# Altium project USBIsolator.PrjPcb
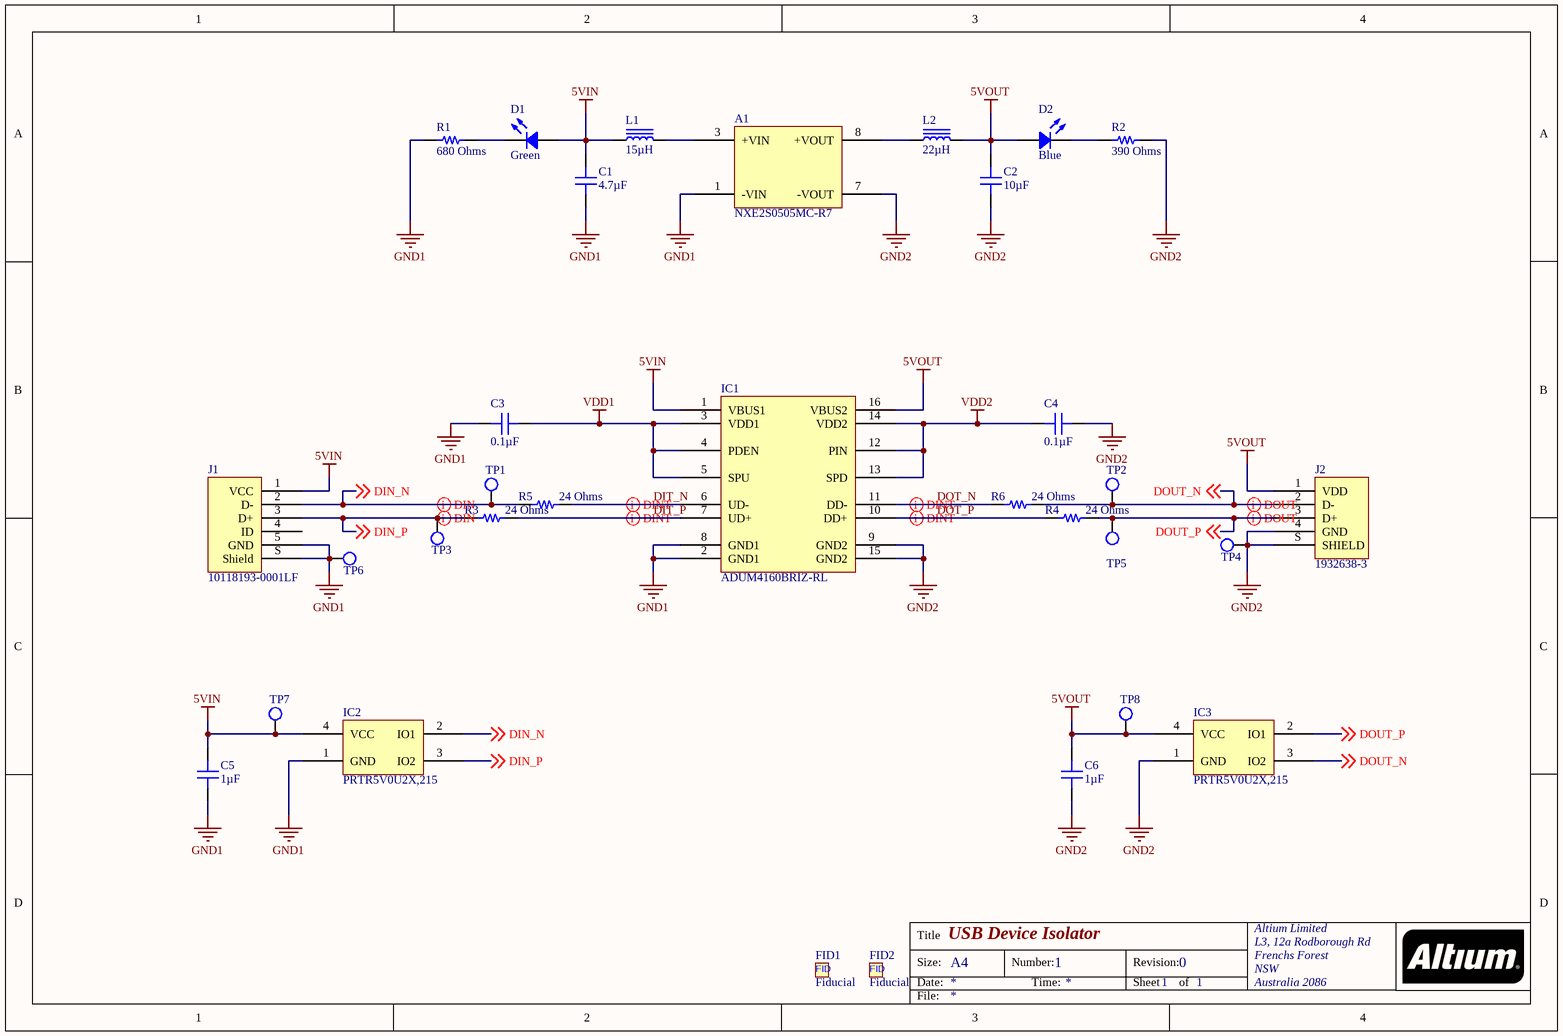
[diagram p0: USB Isolator.SchDoc]
1 sheet, 32 parts. Net scope: global (net labels, ports and power ports of the same name join across sheets).
Board files: USB Isolator Board.PcbDoc, USB Isolator Panel.PcbDoc

## Sheet USB Isolator.SchDoc: USB Device Isolator
size A4; Organization: Altium Limited; Address1: L3, 12a Rodborough Rd; Address2: Frenchs Forest; Address3: NSW; Address4: Australia 2086; DocumentNumber: 1; Revision: 0; SheetNumber: 1; SheetTotal: 1

### Parts
A1  NXE2S0505MC-R7  [MURATA NXE]
C1  4.7µF  [CAP 1206_3216 - 1.8MM]
C2  10µF  [CAP 1206_3216 - 1.8MM]
C3  0.1µF  [CAP 0603_1608]
C4  0.1µF  [CAP 0603_1608]
C5  1µF  [CAP 0603_1608]
C6  1µF  [CAP 0603_1608]
D1  Green  [LED 0603_1608 GREEN]
D2  Blue  [LED 0603_1608 BLUE]
FID1  Fiducial  [Fiducial-1mm]
FID2  Fiducial  [Fiducial-1mm]
IC1  ADUM4160BRIZ-RL  [ANALOG DEV SOIC-16 RI-16-1]
IC2  PRTR5V0U2X,215  [SOT143B]
IC3  PRTR5V0U2X,215  [SOT143B]
J1  10118193-0001LF  [FCI USB 10118193-0001LF]
J2  1932638-3  [TE 1932638-3 USB2.0A]
L1  15µH  [TDK VLCF4028-2]
L2  22µH  [TDK VLCF4024-2]
R1  680 Ohms  [RES 0603_1608]
R2  390 Ohms  [RES 0603_1608]
R3  24 Ohms  [RES 0603_1608]
R4  24 Ohms  [RES 0603_1608]
R5  24 Ohms  [RES 0603_1608]
R6  24 Ohms  [RES 0603_1608]
TP1  Test Point  [TestPoint-1.5mm]  (value not drawn)  (no BOM)
TP2  Test Point  [TestPoint-1.5mm]  (value not drawn)  (no BOM)
TP3  Test Point  [TestPoint-1.5mm]  (value not drawn)  (no BOM)
TP4  Test Point  [TestPoint-1.5mm]  (value not drawn)  (no BOM)
TP5  Test Point  [TestPoint-1.5mm]  (value not drawn)  (no BOM)
TP6  Test Point  [TestPoint-1.5mm]  (value not drawn)  (no BOM)
TP7  Test Point  [TestPoint-1.5mm]  (value not drawn)  (no BOM)
TP8  Test Point  [TestPoint-1.5mm]  (value not drawn)  (no BOM)

### Nets
5VIN: C1.1 C5.1 D1.1 IC1.1(VBUS1) IC2.4(VCC) J1.1(VCC) L1.1 TP7.1(TP)
5VOUT: C2.1 C6.1 D2.1 IC1.16(VBUS2) IC3.4(VCC) J2.1(VDD) L2.2 TP8.1(TP)
GND1: A1.1(-VIN) C1.2 C3.1 C5.2 IC1.2(GND1) IC1.8(GND1) IC2.1(GND) J1.5(GND) J1.S(Shield) R1.1 TP6.1(TP)
GND2: A1.7(-VOUT) C2.2 C4.1 C6.2 IC1.9(GND2) IC1.15(GND2) IC3.1(GND) J2.4(GND) J2.S(SHIELD) R2.2 TP4.1(TP)
VDD1: C3.2 IC1.3(VDD1) IC1.4(PDEN) IC1.5(SPU)
VDD2: C4.2 IC1.12(PIN) IC1.13(SPD) IC1.14(VDD2)
DIN_N: IC2.2(IO1) J1.2(D-) R5.2 TP1.1(TP) ; off-sheet DIN_N
DIN_P: IC2.3(IO2) J1.3(D+) R3.2 TP3.1(TP) ; off-sheet DIN_P
DIT_N: IC1.6(UD-) R5.1
DIT_P: IC1.7(UD+) R3.1
DOT_N: IC1.11(DD-) R6.2
DOT_P: IC1.10(DD+) R4.2
DOUT_N: IC3.3(IO2) J2.2(D-) R6.1 TP2.1(TP) ; off-sheet DOUT_N
DOUT_P: IC3.2(IO1) J2.3(D+) R4.1 TP5.1(TP) ; off-sheet DOUT_P
NetA1_3: A1.3(+VIN) L1.2
NetA1_8: A1.8(+VOUT) L2.1
NetD1_2: D1.2 R1.2
NetD2_2: D2.2 R2.1

Not connected (* = marked no-connect by the designer): J1 4(ID)

### Layout directives
differential pair: DIN_N, DIN_P, DIT_N, DIT_P, DOT_N, DOT_P, DOUT_N, DOUT_P

### Notes on the sheet
- Title
- Size:
- Date:
- A4
- Number:
- Time:
- Revision:
- Sheet
- of
- File:
- (in symbol Fiducial) FID

### Library data of the parts
A1 = NXE2S0505MC-R7: DC DC CONVERTER 5V 2W; Manufacturer: Murata Power Solutions Inc.; Current - Output (Max): 400mA; Efficiency: 72%; Number of Outputs: 1; Voltage - Input (Max): 5.5V; Voltage - Input (Min): 4.5V; Voltage - Isolation: 3kV; Part Number: NXE2S0505MC-R7; Applications: ITE (Commercial); ComponentLink1Description: Datasheet; ComponentLink1URL: https://power.murata.com/data/power/ncl/kdc_nxe2.pdf; ComponentLink2Description: DigiKey Link; ComponentLink2URL: //digikey.com/product-detail/en/murata-power-solutions-inc/NXE2S0505MC-R7/811-3182-2-ND/6009739; Device Package: 14-SMD Module, 5 Leads; Features: SCP; LastUpdated: 04/12/2019 23:42:39; Lifecycle Status: 0; Minimum Order: 1; Mounting Type: Surface Mount; Operating Temperature: -40°C ~ 85°C; Package / Case: 14-SMD Module, 5 Leads; Packaging: TapeAndReel; PartId: 2; Part Status: Active; Power (Watts): 2W; Price: 3.83; Series: NXE2 (2W); Size / Dimension: 0.50" L x 0.40" W x 0.17" H (12.7mm x 10.4mm x 4.4mm); Supplier 1: DigiKey; Supplier Part Number 1: 811-3182-2-ND; Type: Isolated Module; Voltage - Output 1: 5V
C1 = CL31B475KOHNNNE: CAP CER 4.7UF 16V X7R 1206; Manufacturer: Samsung Electro-Mechanics; Tolerance: ±10%; Part Number: CL31B475KOHNNNE; Applications: General Purpose; Capacitance: 4.7µF; ComponentLink1Description: Datasheet; ComponentLink1URL: http://www.samsungsem.com/kr/support/product-search/mlcc/CL31B475KOHNNNE.jsp; ComponentLink2Description: DigiKey Link; ComponentLink2URL: //digikey.com/product-detail/en/samsung-electro-mechanics/CL31B475KOHNNNE/1276-3182-2-ND/3888840; Device Package: 1206 (3216 Metric); LastUpdated: 29/11/2019 21:36:24; Lifecycle Status: 0; Minimum Order: 1; Mounting Type: Surface Mount, MLCC; Operating Temperature: -55°C ~ 125°C; Package / Case: 1206 (3216 Metric); Packaging: TapeAndReel; PartId: 22712; Part Status: Active; Price: 0.05; Series: CL; Size / Dimension: 0.126" L x 0.063" W (3.20mm x 1.60mm); Supplier 1: DigiKey; Supplier Part Number 1: 1276-3182-2-ND; Temperature Coefficient: X7R; Thickness (Max): 0.071" (1.80mm); Value: 4.7µF; Voltage - Rated: 16V
C2 = CL31B106MOHNNNE: CAP CER 10UF 16V X7R 1206; Manufacturer: Samsung Electro-Mechanics; Tolerance: ±20%; Part Number: CL31B106MOHNNNE; Applications: General Purpose; Capacitance: 10µF; ComponentLink1Description: Datasheet; ComponentLink1URL: http://www.samsungsem.com/kr/support/product-search/mlcc/CL31B106MOHNNNE.jsp; ComponentLink2Description: DigiKey Link; ComponentLink2URL: //digikey.com/product-detail/en/samsung-electro-mechanics/CL31B106MOHNNNE/1276-6641-2-ND/5961125; Device Package: 1206 (3216 Metric); LastUpdated: 29/11/2019 21:36:18; Lifecycle Status: 0; Minimum Order: 1; Mounting Type: Surface Mount, MLCC; Operating Temperature: -55°C ~ 125°C; Package / Case: 1206 (3216 Metric); Packaging: TapeAndReel; PartId: 21983; Part Status: Active; Price: 0.04; Series: CL; Size / Dimension: 0.126" L x 0.063" W (3.20mm x 1.60mm); Supplier 1: DigiKey; Supplier Part Number 1: 1276-6641-2-ND; Temperature Coefficient: X7R; Thickness (Max): 0.071" (1.80mm); Value: 10µF; Voltage - Rated: 16V
C3 C4 = CL10B104KB8NNNL: CAP CER 0.1UF 50V X7R 0603; Manufacturer: Samsung Electro-Mechanics; Tolerance: ±10%; Part Number: CL10B104KB8NNNL; Applications: General Purpose; Capacitance: 0.1µF; ComponentLink1Description: Datasheet; ComponentLink1URL: http://www.samsungsem.com/kr/support/product-search/mlcc/CL10B104KB8NNNL.jsp; ComponentLink2Description: DigiKey Link; ComponentLink2URL: //digikey.com/product-detail/en/samsung-electro-mechanics/CL10B104KB8NNNL/1276-CL10B104KB8NNNLTR-ND/3894274; Device Package: 0603 (1608 Metric); LastUpdated: 29/11/2019 20:59:46; Lifecycle Status: 0; Minimum Order: 1; Mounting Type: Surface Mount, MLCC; Operating Temperature: -55°C ~ 125°C; Package / Case: 0603 (1608 Metric); Packaging: TapeAndReel; PartId: 3517; Part Status: Active; Price: 0.00; Series: CL; Size / Dimension: 0.063" L x 0.031" W (1.60mm x 0.80mm); Supplier 1: DigiKey; Supplier Part Number 1: 1276-CL10B104KB8NNNLTR-ND; Temperature Coefficient: X7R; Thickness (Max): 0.035" (0.90mm); Value: 0.1µF; Voltage - Rated: 50V
C5 C6 = CC0603KRX5R8BB105: CAP CER 1UF 25V X5R 0603; Manufacturer: Yageo; Tolerance: ±10%; Part Number: CC0603KRX5R8BB105; Applications: General Purpose; Capacitance: 1µF; ComponentLink1Description: Datasheet; ComponentLink1URL: https://www.yageo.com/upload/media/product/productsearch/datasheet/mlcc/UPY-GPHC_X5R_4V-to-50V_25.pdf; ComponentLink2Description: DigiKey Link; ComponentLink2URL: //digikey.com/product-detail/en/yageo/CC0603KRX5R8BB105/311-1445-2-ND/2833610; Device Package: 0603 (1608 Metric); LastUpdated: 29/11/2019 20:59:49; Lifecycle Status: 0; Minimum Order: 1; Mounting Type: Surface Mount, MLCC; Operating Temperature: -55°C ~ 85°C; Package / Case: 0603 (1608 Metric); Packaging: TapeAndReel; PartId: 5146; Part Status: Active; Price: 0.01; Series: CC; Size / Dimension: 0.063" L x 0.031" W (1.60mm x 0.80mm); Supplier 1: DigiKey; Supplier Part Number 1: 311-1445-2-ND; Temperature Coefficient: X5R; Thickness (Max): 0.035" (0.90mm); Value: 1µF; Voltage - Rated: 25V
D1 = LTST-C191KGKT: LED GREEN CLEAR SMD; Manufacturer: Lite-On Inc.; Configuration: Standard; Current - Test: 20mA; Lens Color: Colorless; Lens Size: 1.10mm x 0.80mm; Lens Style: Rectangle with Flat Top; Millicandela Rating: 35mcd; Viewing Angle: 130°; Voltage - Forward (Vf) (Typ): 2V; Wavelength - Dominant: 571nm; Wavelength - Peak: 574nm; Part Number: LTST-C191KGKT; Color: Green; ComponentLink1Description: Datasheet; ComponentLink1URL: http://optoelectronics.liteon.com/upload/download/DS22-2000-228/LTST-C191KGKT.PDF; ComponentLink2Description: DigiKey Link; ComponentLink2URL: //digikey.com/product-detail/en/lite-on-inc/LTST-C191KGKT/160-1446-2-ND/386835; Device Package: 0603 (1608 Metric); Height (Max): 0.65mm; LastUpdated: 01/12/2019 14:50:11; Lens Transparency: Clear; Lifecycle Status: 0; Minimum Order: 1; Mounting Type: Surface Mount; Package / Case: 0603 (1608 Metric); Packaging: TapeAndReel; PartId: 655; Part Status: Active; Price: 0.04; Series: -; Size / Dimension: 1.60mm L x 0.80mm W; Supplier 1: DigiKey; Supplier Part Number 1: 160-1446-2-ND; Value: Green
D2 = LTST-C194TBKT: LED BLUE CLEAR SMD; Manufacturer: Lite-On Inc.; Configuration: Standard; Current - Test: 20mA; Lens Color: Colorless; Lens Size: 1.15mm x 0.80mm; Lens Style: Rectangle with Flat Top; Millicandela Rating: 104mcd; Viewing Angle: 130°; Voltage - Forward (Vf) (Typ): 3.3V; Wavelength - Dominant: 468nm; Part Number: LTST-C194TBKT; Color: Blue; ComponentLink1Description: Datasheet; ComponentLink1URL: http://optoelectronics.liteon.com/upload/download/DS22-2010-0025/LTST-C194TBKT.PDF; ComponentLink2Description: DigiKey Link; ComponentLink2URL: //digikey.com/product-detail/en/lite-on-inc/LTST-C194TBKT/160-1837-2-ND/2356225; Device Package: 0603 (1608 Metric); Height (Max): 0.45mm; LastUpdated: 01/12/2019 14:50:37; Lens Transparency: Clear; Lifecycle Status: 0; Minimum Order: 1; Mounting Type: Surface Mount; Package / Case: 0603 (1608 Metric); Packaging: TapeAndReel; PartId: 828; Part Status: Active; Price: 0.06; Series: -; Size / Dimension: 1.60mm L x 0.80mm W; Supplier 1: DigiKey; Supplier Part Number 1: 160-1837-2-ND; Value: Blue; Wavelength - Peak: 468nm
IC1 = ADUM4160BRIZ-RL: DGTL ISOLATOR 5KV 2CH USB 16SOIC; Manufacturer: Analog Devices Inc.; Channel Type: Bidirectional; Common Mode Transient Immunity (Min): 25kV/µs; Data Rate: 12Mbps; Inputs - Side 1/Side 2: 2/2; Isolated Power: No; Number of Channels: 2; Propagation Delay tpLH / tpHL (Max): 70ns, 70ns; Rise / Fall Time (Typ): 20ns, 20ns (Max); Voltage - Isolation: 5000Vrms; Voltage - Supply: 3.1V ~ 5.5V; Part Number: ADUM4160BRIZ-RL; ComponentLink1Description: Datasheet; ComponentLink1URL: https://www.analog.com/media/en/technical-documentation/data-sheets/ADuM4160.pdf; ComponentLink2Description: DigiKey Link; ComponentLink2URL: //digikey.com/product-detail/en/analog-devices-inc/ADUM4160BRIZ-RL/ADUM4160BRIZ-RLTR-ND/2700137; Device Package: 16-SOIC (0.295", 7.50mm Width); LastUpdated: 09/12/2019 20:48:06; Lifecycle Status: 0; Minimum Order: 1; Mounting Type: Surface Mount; Operating Temperature: -40°C ~ 105°C; Package / Case: 16-SOIC (0.295", 7.50mm Width); Packaging: TapeAndReel; PartId: 48; Part Status: Active; Price: 6.80; Series: iCoupler®; Supplier 1: DigiKey; Supplier Part Number 1: ADUM4160BRIZ-RLTR-ND; Supplier Device Package: 16-SOIC-IC; Technology: Magnetic Coupling; Type: USB
IC2 IC3 = PRTR5V0U2X,215: TVS DIODE 5.5V SOT143B; Manufacturer: Nexperia USA Inc.; Capacitance @ Frequency: 1pF @ 1MHz; Power Line Protection: Yes; Unidirectional Channels: 2; Voltage - Breakdown (Min): 6V; Voltage - Reverse Standoff (Typ): 5.5V (Max); Part Number: PRTR5V0U2X,215; Applications: General Purpose; ComponentLink1Description: Datasheet; ComponentLink1URL: https://assets.nexperia.com/documents/data-sheet/PRTR5V0U2X.pdf; ComponentLink2Description: DigiKey Link; ComponentLink2URL: //digikey.com/product-detail/en/nexperia-usa-inc/PRTR5V0U2X215/1727-3884-2-ND/1163690; Device Package: TO-253-4, TO-253AA; LastUpdated: 09/12/2019 21:29:05; Lifecycle Status: 0; Minimum Order: 1; Mounting Type: Surface Mount; Operating Temperature: -40°C ~ 85°C (TA); Package / Case: TO-253-4, TO-253AA; Packaging: TapeAndReel; PartId: 5451; Part Status: Active; Price: 0.18; Series: -; Supplier 1: DigiKey; Supplier Part Number 1: 1727-3884-2-ND; Supplier Device Package: SOT-143B; Type: Steering (Rail to Rail)
J1 = 10118193-0001LF: CONN RCPT USB2.0 MICRO B SMD R/A; Manufacturer: Amphenol ICC (FCI); Connector Type: USB - micro B; Current Rating (Amps): 1.8A per Contact; Gender: Receptacle; Mating Cycles: 10000; Number of Contacts: 5; Number of Ports: 1; Shielding: Shielded; Voltage - Rated: 100VAC; Part Number: 10118193-0001LF; ComponentLink1Description: Datasheet; ComponentLink1URL: https://cdn.amphenol-icc.com/media/wysiwyg/files/documentation/datasheet/inputoutput/io_usb_micro.pdf; ComponentLink2Description: DigiKey Link; ComponentLink2URL: //digikey.com/product-detail/en/amphenol-icc-fci/10118193-0001LF/609-4616-2-ND/2785388; Features: Solder Retention; LastUpdated: 09/12/2019 20:51:28; Lifecycle Status: 0; Minimum Order: 1; Mounting Feature: Horizontal; Mounting Type: Surface Mount, Right Angle; Through Hole; Operating Temperature: -30°C ~ 80°C; Packaging: TapeAndReel; Part Status: Active; Price: 0.21; Series: -; Specifications: USB 2.0; Supplier 1: DigiKey; Supplier Part Number 1: 609-4616-2-ND; Termination: Solder
J2 = 1932638-3: CONN RCPT USB2.0 TYPEA 4P SMD RA; Manufacturer: TE Connectivity AMP Connectors; Connector Type: USB - A; Current Rating (Amps): 1A per Contact; Gender: Receptacle; Mating Cycles: 1500; Number of Contacts: 4; Number of Ports: 1; Shielding: Shielded; Voltage - Rated: 30VAC; Part Number: 1932638-3; ComponentLink1Description: Datasheet; ComponentLink1URL: https://www.te.com/commerce/DocumentDelivery/DDEController?Action=srchrtrv&DocNm=501-60007-1&DocType=SS&DocLang=EN; ComponentLink2Description: DigiKey Link; ComponentLink2URL: //digikey.com/product-detail/en/te-connectivity-amp-connectors/1932638-3/A117902TR-ND/4731612; Features: Solder Retention; LastUpdated: 09/12/2019 20:47:08; Lifecycle Status: 0; Minimum Order: 1; Mounting Feature: Horizontal; Mounting Type: Surface Mount, Right Angle; Operating Temperature: -55°C ~ 85°C; Packaging: TapeAndReel; Part Status: Active; Price: 0.97; Series: -; Specifications: USB 2.0; Supplier 1: DigiKey; Supplier Part Number 1: A117902TR-ND; Termination: Solder
L1 = VLCF4028T-150MR88-2: FIXED IND 15UH 880MA 170 MOHM; Manufacturer: TDK Corporation; DC Resistance (DCR): 170mOhm Max; Inductance Frequency - Test: 100kHz; Material - Core: Ferrite; Shielding: Shielded; Tolerance: ±20%; Type: Wirewound; Part Number: VLCF4028T-150MR88-2; ComponentLink1Description: Datasheet; ComponentLink1URL: https://product.tdk.com/info/en/catalog/datasheets/inductor_commercial_power_vlcf4028-2_en.pdf?ref_disty=digikey; ComponentLink2Description: DigiKey Link; ComponentLink2URL: //digikey.com/product-detail/en/tdk-corporation/VLCF4028T-150MR88-2/445-6543-2-ND/2465300; Current Rating (Amps): 880mA; Current - Saturation: 880mA; Device Package: Nonstandard; Height - Seated (Max): 0.110" (2.80mm); Inductance: 15µH; LastUpdated: 02/12/2019 13:32:15; Lifecycle Status: 0; Minimum Order: 1; Mounting Type: Surface Mount; Operating Temperature: -40°C ~ 105°C; Package / Case: Nonstandard; Packaging: TapeAndReel; PartId: 183; Part Status: Active; Price: 0.44; Series: VLCF; Size / Dimension: 0.157" L x 0.157" W (4.00mm x 4.00mm); Supplier 1: DigiKey; Supplier Part Number 1: 445-6543-2-ND; Value: 15µH
L2 = VLCF4024T-220MR65-2: FIXED IND 22UH 650MA 332 MOHM; Manufacturer: TDK Corporation; DC Resistance (DCR): 332mOhm Max; Inductance Frequency - Test: 100kHz; Material - Core: Ferrite; Shielding: Shielded; Tolerance: ±20%; Type: Wirewound; Part Number: VLCF4024T-220MR65-2; ComponentLink1Description: Datasheet; ComponentLink1URL: https://product.tdk.com/info/en/catalog/datasheets/inductor_commercial_power_vlcf4024-2_en.pdf?ref_disty=digikey; ComponentLink2Description: DigiKey Link; ComponentLink2URL: //digikey.com/product-detail/en/tdk-corporation/VLCF4024T-220MR65-2/445-8732-2-ND/3083283; Current Rating (Amps): 650mA; Current - Saturation: 650mA; Device Package: Nonstandard; Height - Seated (Max): 0.094" (2.40mm); Inductance: 22µH; LastUpdated: 02/12/2019 13:29:53; Lifecycle Status: 0; Minimum Order: 1; Mounting Type: Surface Mount; Operating Temperature: -40°C ~ 105°C; Package / Case: Nonstandard; Packaging: TapeAndReel; PartId: 165; Part Status: Active; Price: 0.44; Series: VLCF; Size / Dimension: 0.157" L x 0.157" W (4.00mm x 4.00mm); Supplier 1: DigiKey; Supplier Part Number 1: 445-8732-2-ND; Value: 22µH
R1 = CR0603-JW-681ELF: RES SMD 680 OHM 5% 1/10W 0603; Manufacturer: Bourns Inc.; Power (Watts): 0.1W, 1/10W; Temperature Coefficient: ±200ppm/°C; Part Number: CR0603-JW-681ELF; ComponentLink1Description: Datasheet; ComponentLink1URL: https://www.bourns.com/docs/Product-Datasheets/CHPREZTR.pdf; ComponentLink2Description: DigiKey Link; ComponentLink2URL: //digikey.com/product-detail/en/bourns-inc/CR0603-JW-681ELF/CR0603-JW-681ELFTR-ND/3784416; Composition: Thick Film; Device Package: 0603 (1608 Metric); Features: Moisture Resistant; Height - Seated (Max): 0.022" (0.55mm); LastUpdated: 29/11/2019 21:00:44; Lifecycle Status: 0; Minimum Order: 1; Number of Terminations: 2; Operating Temperature: -55°C ~ 155°C; Package / Case: 0603 (1608 Metric); Packaging: TapeAndReel; PartId: 6073; Part Status: Active; Price: 0.00; Resistance: 680 Ohms; Series: CR0603; Size / Dimension: 0.063" L x 0.031" W (1.60mm x 0.80mm); Supplier 1: DigiKey; Supplier Part Number 1: CR0603-JW-681ELFTR-ND; Supplier Device Package: 0603; Tolerance: ±5%; Value: 680 Ohms
R2 = CRCW0603390RFKEA: RES SMD 390 OHM 1% 1/10W 0603; Manufacturer: Vishay Dale; Power (Watts): 0.1W, 1/10W; Temperature Coefficient: ±100ppm/°C; Part Number: CRCW0603390RFKEA; ComponentLink1Description: Datasheet; ComponentLink1URL: http://www.vishay.com/docs/20035/dcrcwe3.pdf; ComponentLink2Description: DigiKey Link; ComponentLink2URL: //digikey.com/product-detail/en/vishay-dale/CRCW0603390RFKEA/541-390HTR-ND/1174620; Composition: Thick Film; Device Package: 0603 (1608 Metric); Features: Automotive AEC-Q200; Height - Seated (Max): 0.020" (0.50mm); LastUpdated: 29/11/2019 21:00:48; Lifecycle Status: 0; Minimum Order: 1; Number of Terminations: 2; Operating Temperature: -55°C ~ 155°C; Package / Case: 0603 (1608 Metric); Packaging: TapeAndReel; PartId: 7821; Part Status: Active; Price: 0.00; Ratings: AEC-Q200; Resistance: 390 Ohms; Series: CRCW; Size / Dimension: 0.061" L x 0.033" W (1.55mm x 0.85mm); Supplier 1: DigiKey; Supplier Part Number 1: 541-390HTR-ND; Supplier Device Package: 0603; Tolerance: ±1%; Value: 390 Ohms
R3-R6 = CRCW060324R0FKEA: RES SMD 24 OHM 1% 1/10W 0603; Manufacturer: Vishay Dale; Power (Watts): 0.1W, 1/10W; Temperature Coefficient: ±100ppm/°C; Part Number: CRCW060324R0FKEA; ComponentLink1Description: Datasheet; ComponentLink1URL: http://www.vishay.com/docs/20035/dcrcwe3.pdf; ComponentLink2Description: DigiKey Link; ComponentLink2URL: //digikey.com/product-detail/en/vishay-dale/CRCW060324R0FKEA/541-24.0HTR-ND/1174481; Composition: Thick Film; Device Package: 0603 (1608 Metric); Features: Automotive AEC-Q200; Height - Seated (Max): 0.020" (0.50mm); LastUpdated: 29/11/2019 21:00:49; Lifecycle Status: 0; Minimum Order: 1; Number of Terminations: 2; Operating Temperature: -55°C ~ 155°C; Package / Case: 0603 (1608 Metric); Packaging: TapeAndReel; PartId: 7907; Part Status: Active; Price: 0.00; Ratings: AEC-Q200; Resistance: 24 Ohms; Series: CRCW; Size / Dimension: 0.061" L x 0.033" W (1.55mm x 0.85mm); Supplier 1: DigiKey; Supplier Part Number 1: 541-24.0HTR-ND; Supplier Device Package: 0603; Tolerance: ±1%; Value: 24 Ohms